# Altium schematic sheet Mechanical and Interconnect.SchDoc: Mechanical and Interconnect
size 420 x 297 mm; Address1: CryptUS; Address3: Pascal-Emmanuel Lachance; Address4: Benjamin Gélinas; Revision: A; SheetNumber: 2; SheetTotal: 7
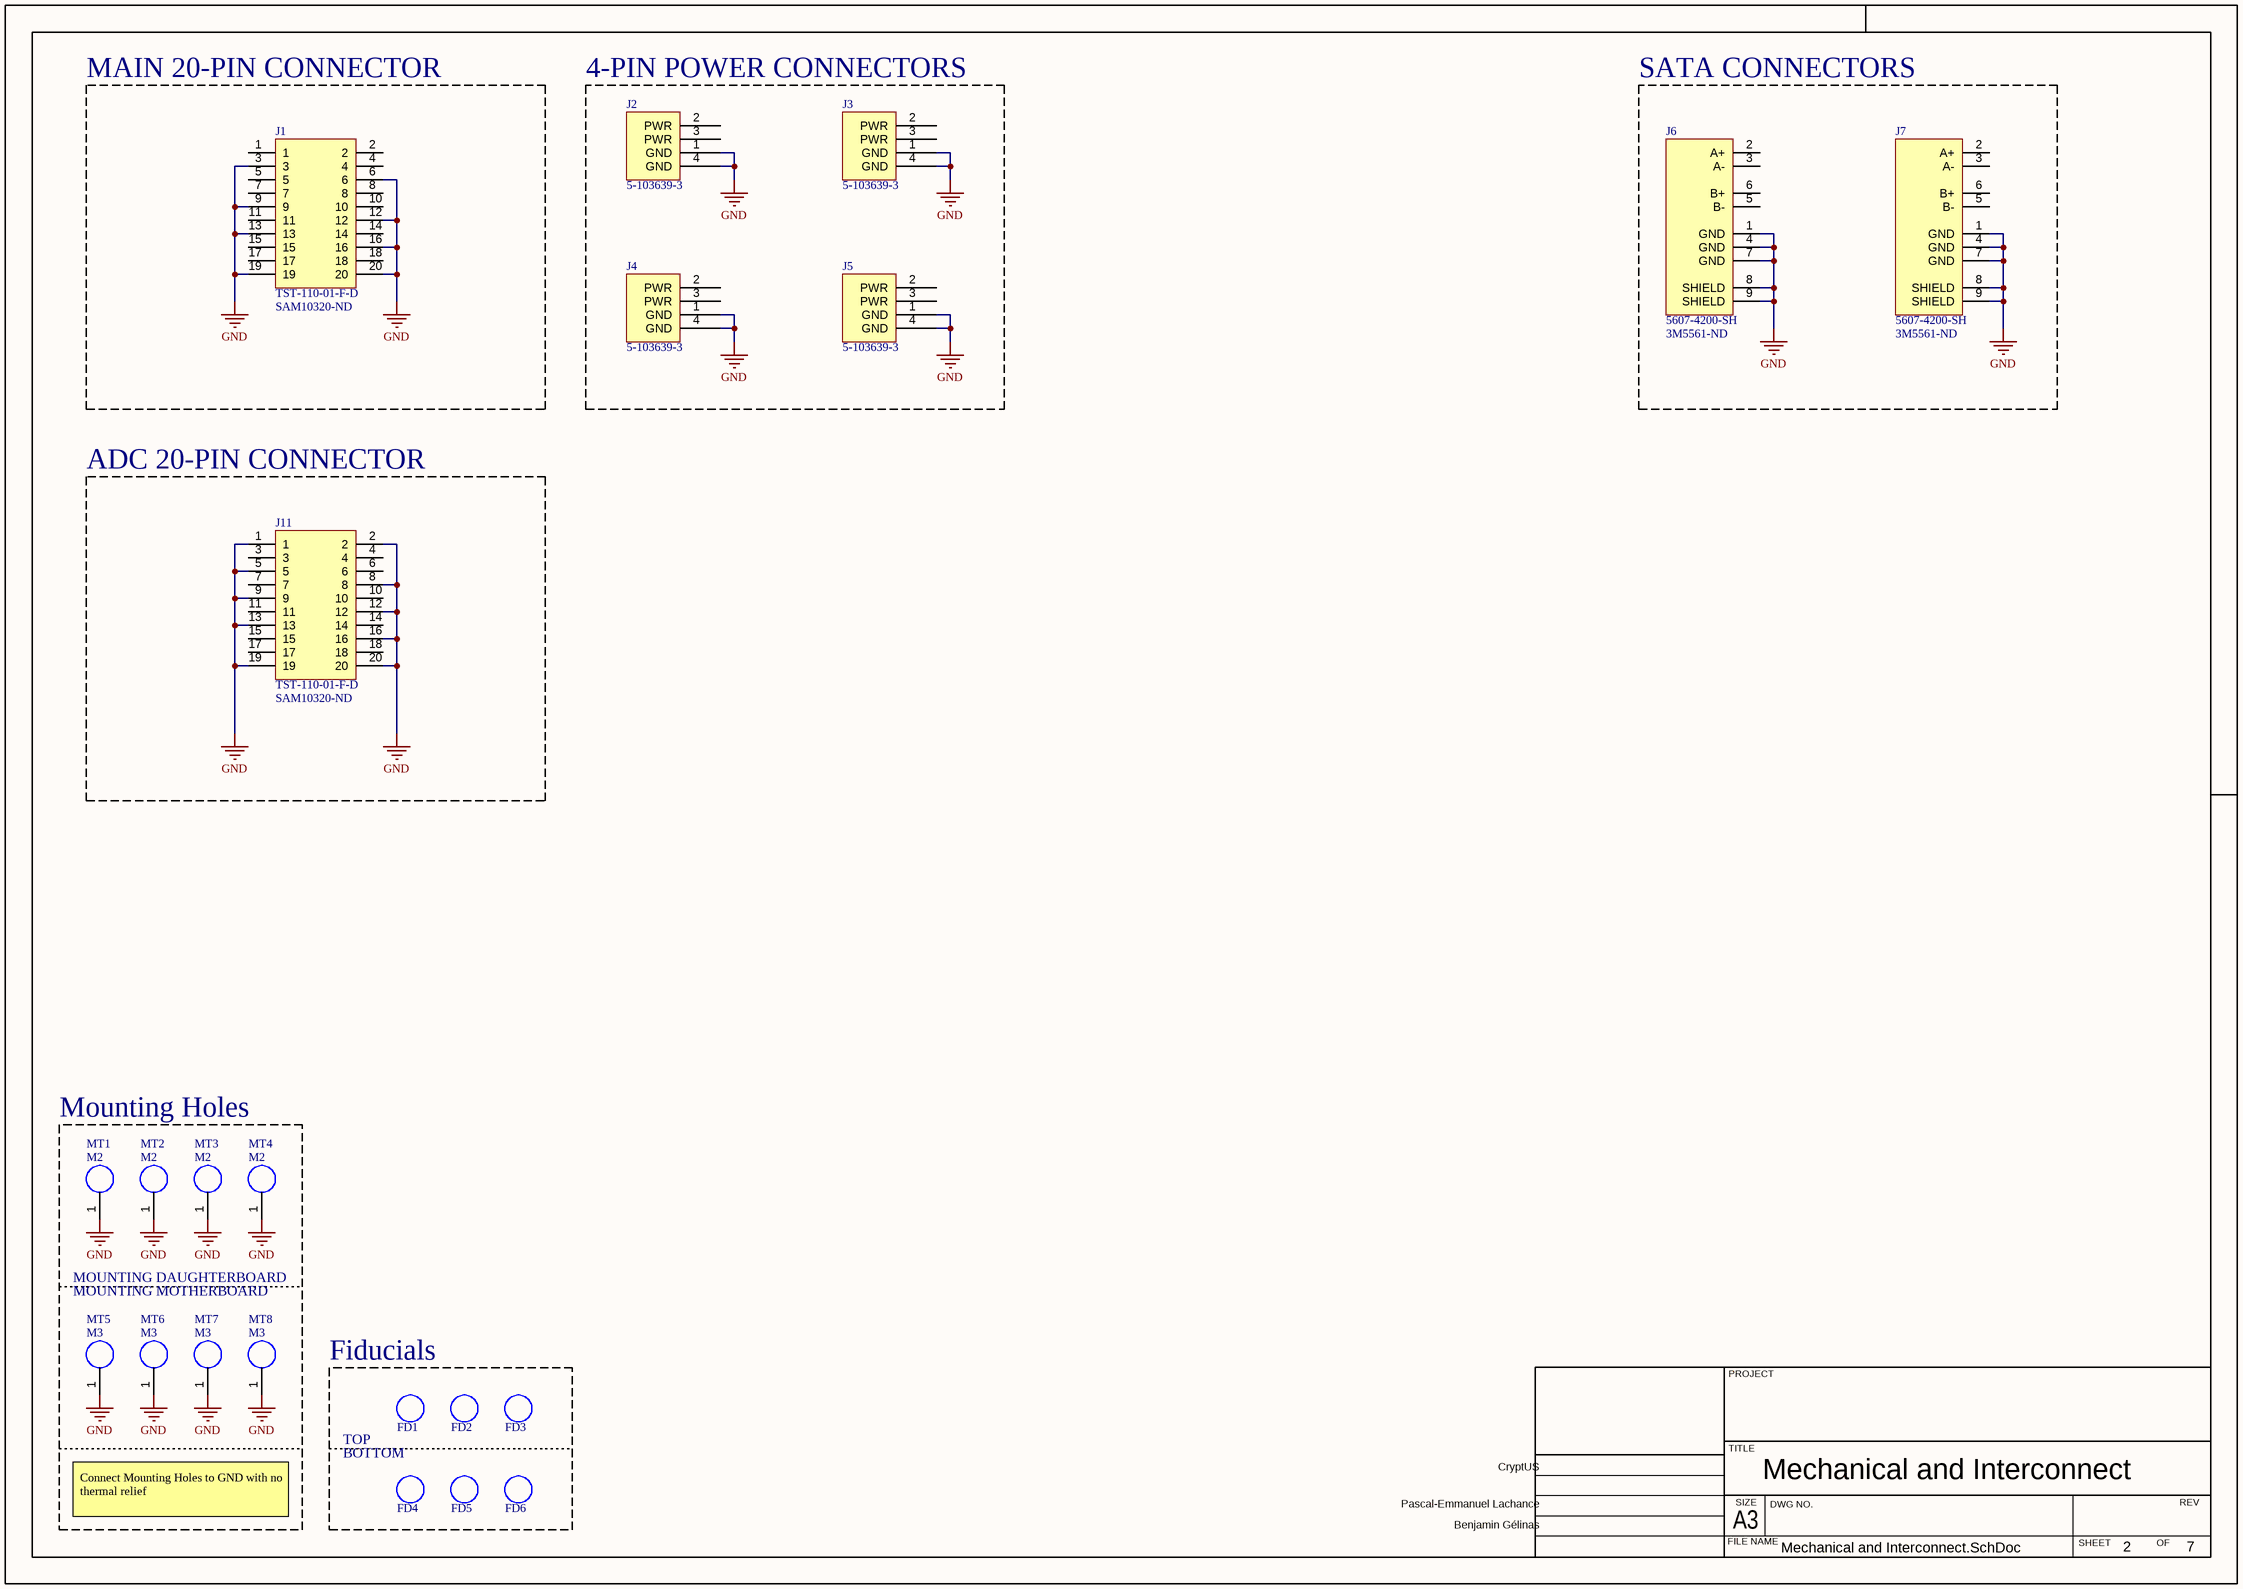
[diagram p0: Mechanical and Interconnect.SchDoc]

## Parts
FD1  FIDUCIAL  [FIDUCIAL]  (value not drawn)
FD2  FIDUCIAL  [FIDUCIAL]  (value not drawn)
FD3  FIDUCIAL  [FIDUCIAL]  (value not drawn)
FD4  FIDUCIAL  [FIDUCIAL]  (value not drawn)
FD5  FIDUCIAL  [FIDUCIAL]  (value not drawn)
FD6  FIDUCIAL  [FIDUCIAL]  (value not drawn)
J1  TST-110-01-F-D  Supplier Part Number 1: SAM10320-ND  [TST-110-01-F-D]
J2  5-103639-3  [5-103639-3]
J3  5-103639-3  [5-103639-3]
J4  5-103639-3  [5-103639-3]
J5  5-103639-3  [5-103639-3]
J6  5607-4200-SH  Supplier Part Number 1: 3M5561-ND  [5607-4200-SH]
J7  5607-4200-SH  Supplier Part Number 1: 3M5561-ND  [5607-4200-SH]
J11  TST-110-01-F-D  Supplier Part Number 1: SAM10320-ND  [TST-110-01-F-D]
MT1  M2  [MTH_M2]
MT2  M2  [MTH_M2]
MT3  M2  [MTH_M2]
MT4  M2  [MTH_M2]
MT5  M3  [MTH_M3]
MT6  M3  [MTH_M3]
MT7  M3  [MTH_M3]
MT8  M3  [MTH_M3]

## Blocks framed on the sheet
MAIN 20-PIN CONNECTOR: J1
4-PIN POWER CONNECTORS: J2-J5
SATA CONNECTORS: J6 J7
ADC 20-PIN CONNECTOR: J11
Mounting Holes: MT1-MT8
Fiducials: FD1-FD6

## Nets
GND: J1.3 J1.6 J1.9 J1.12 J1.13 J1.16 J1.19 J1.20 J2.1(GND) J2.4(GND) J3.1(GND) J3.4(GND) J4.1(GND) J4.4(GND) J5.1(GND) J5.4(GND) J6.1(GND) J6.4(GND) J6.7(GND) J6.8(SHIELD) J6.9(SHIELD) J7.1(GND) J7.4(GND) J7.7(GND) J7.8(SHIELD) J7.9(SHIELD) J11.1 J11.2 J11.5 J11.8 J11.9 J11.12 J11.13 J11.16 J11.19 J11.20 MT1.1 MT2.1 MT3.1 MT4.1 MT5.1 MT6.1 MT7.1 MT8.1

Not connected (* = marked no-connect by the designer): J1 1 2 4 5 7 8 10 11 14 15 17 18; J2 2(PWR) 3(PWR); J3 2(PWR) 3(PWR); J4 2(PWR) 3(PWR); J5 2(PWR) 3(PWR); J6 2(A+) 3(A-) 5(B-) 6(B+); J7 2(A+) 3(A-) 5(B-) 6(B+); J11 3 4 6 7 10 11 14 15 17 18

## Notes on the sheet
- MOUNTING MOTHERBOARD
- MOUNTING DAUGHTERBOARD
- (near FD4) BOTTOM
- TOP
- Connect Mounting Holes to GND with no thermal relief
- PROJECT
- TITLE
- FILE NAME
- A3
- SIZE
- DWG NO.
- SHEET
- OF
- REV

## Library data of the parts
J1 J11 = CONN_TST-100-01-F-D: CONN HEADER VERT 20POS 2.54MM; Mfr: Samtech Inc.; Number of positions: 20; Pitch: 100mils; Contact Length: 250mils; Current Rating: 3.4A per contact; Number of rows: 2; Mounting Type: Through Hole; Operating Temperature: -55C - 125C; Supplier 1: Digi-Key
J2-J5 = CONN_5-103639-3: CONN HEADER VERT 4POS 2.54MM; Mfr: TE Connectivity; Number of positions: 4; Pitch: 100mil; Contact Length: 230mil; Current: 5.2A / contact; Operating Temperature: -65C - 105C
J6 J7 = CONN_5607-4200-SH: 7 Position SATA Plug Connector Solder Surface Mount, Right Angle; Mfr: 3M; Supplier 1: Digi-Key
MT1-MT8 = MOUNTING_HOLE